# EAGLE design TempSensor (EAGLE 7.7.0)
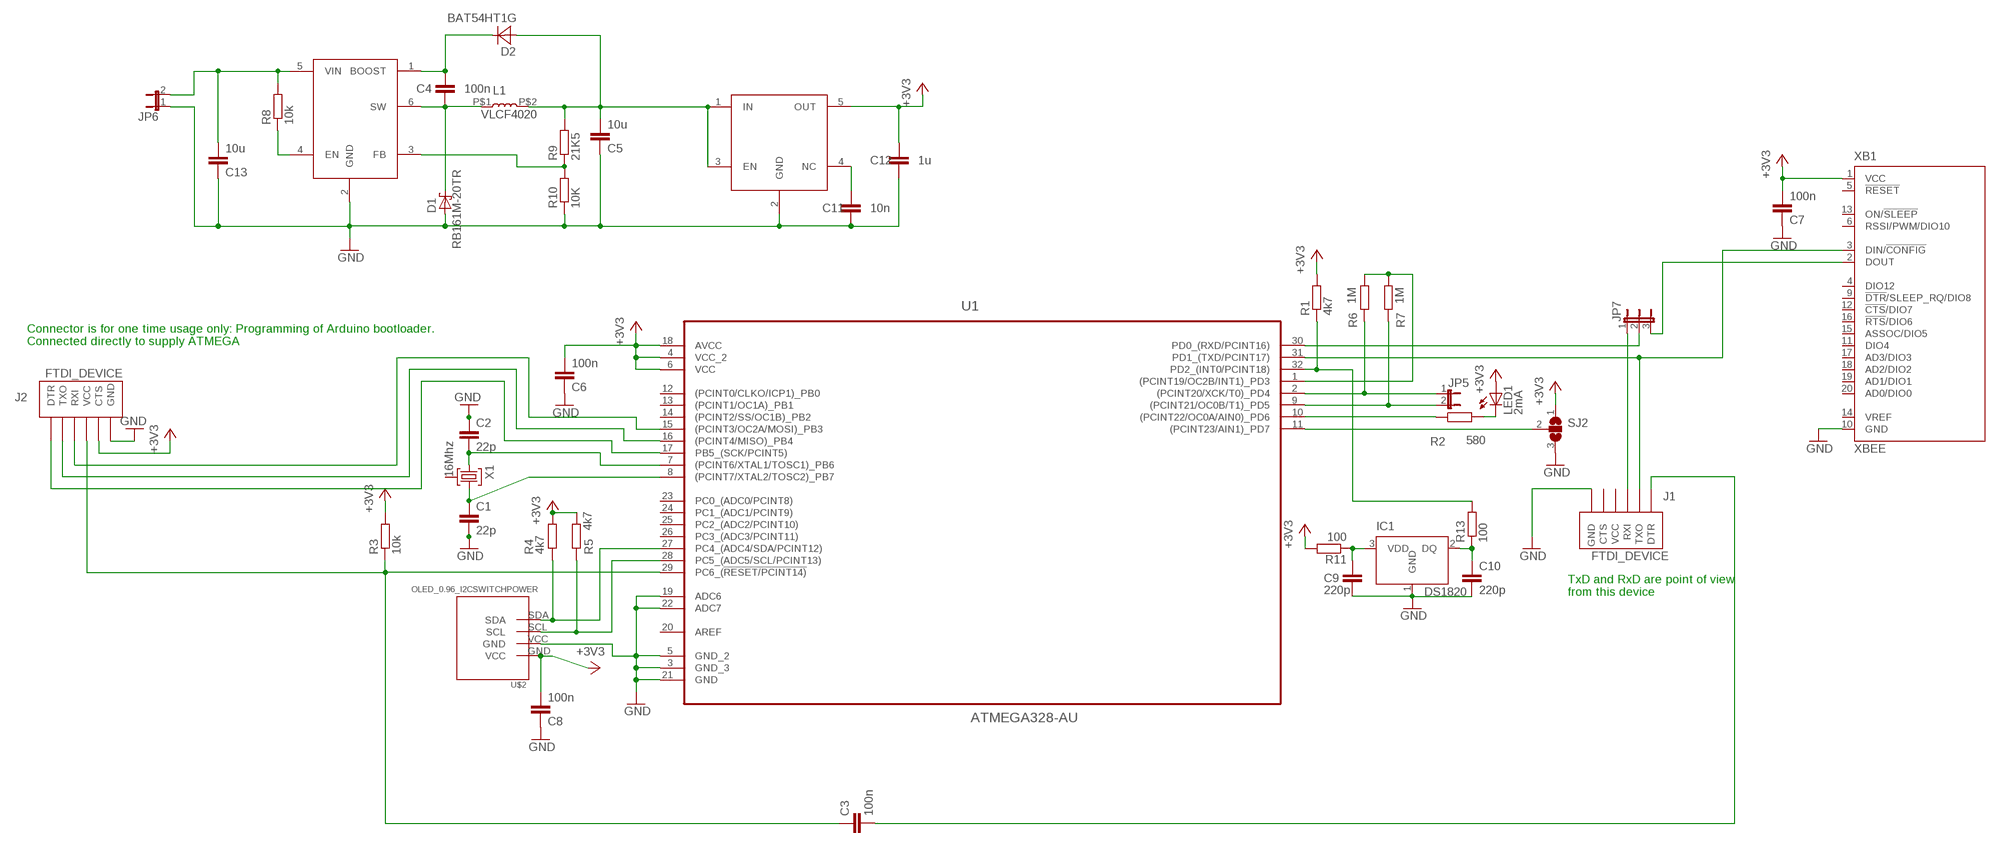
[diagram p0: schematic, sheet 1]

## Parts
C1  22p  C-EUC0805  [C0805]
C2  22p  C-EUC0805  [C0805]
C3  100n  C-EUC0805  [C0805]
C4  100n  C-EUC0805  [C0805]
C5  10u  C-EUC0805  [C0805]
C6  100n  C-EUC0805  [C0805]
C7  100n  C-EUC0805  [C0805]
C8  100n  C-EUC0805  [C0805]
C9  220p  C-EUC0805  [C0805]
C10  220p  C-EUC0805  [C0805]
C11  10n  C-EUC0805  [C0805]
C12  1u  C-EUC0805  [C0805]
C13  10u  C-EUC0805  [C0805]
D1  RB161M-20TR  [SOD123]
D2  BAT54HT1G  [SOD323_ST]
IC1  DS1820  [TO-92]
J1  FTDI_DEVICE  [FTDI_DEVICE_SIDE]
J2  FTDI_DEVICE  [FTDI_DEVICE_SIDE]
JP5  JP1E  [JP1]
JP6  JP1E  [JP1]
JP7  JP2E  [JP2]
L1  VLCF4020  [VLCF4020]
LED1  2mA  LED3MM  [LED3MM]
R1  4k7  R-EU_R0805  [R0805]
R2  580  R-EU_R0603  [R0603]
R3  10k  R-EU_R0805  [R0805]
R4  4k7  R-EU_R0805  [R0805]
R5  4k7  R-EU_R0805  [R0805]
R6  1M  R-EU_R0805  [R0805]
R7  1M  R-EU_R0805  [R0805]
R8  10k  R-EU_R0805  [R0805]
R9  21K5  R-EU_R0805  [R0805]
R10  10K  R-EU_R0805  [R0805]
R11  100  R-EU_R0805  [R0805]
R13  100  R-EU_R0805  [R0805]
SJ2  SJ2W  [SJ_2]
U1  ATMEGA328-AU  [QFP80P900X900X120-32N]
U2  LM2736X  [SOT23-6L]
U3  XC6210  [SOT23-5]
U$2  OLED_0.96_I2CSWITCHPOWER  [OLED_0.96_I2C]
X1  16Mhz  HC49-HC49-3L  [HC49-3L]
XB1  XBEE  [XBEE]

## Nets
+3V3 [Power]: C6.2 C7.2 C8.2 C12.2 J2.P$5(CTS) LED1.A R1.2 R3.2 R4.2 R5.2 R11.2 SJ2.1 U1.4(VCC_2) U1.6(VCC) U1.18(AVCC) U3.5(OUT) U$2.GND(VCC) XB1.1(VCC)
GND [Power]: C1.2 C2.1 C5.1 C6.1 C7.1 C8.1 C9.1 C10.1 C11.1 C12.1 C13.1 D1.A IC1.1(GND) J1.P$6(GND) J2.P$6(GND) JP6.1 R10.1 SJ2.3 U1.3(GND_3) U1.5(GND_2) U1.19(ADC6) U1.21(GND) U1.22(ADC7) U2.2(GND) U3.2(GND) U$2.VCC(GND) XB1.10(GND)
N$1: C2.2 U1.7((PCINT6/XTAL1/TOSC1)_PB6) X1.1
N$2: C1.1 U1.8((PCINT7/XTAL2/TOSC2)_PB7) X1.3
N$3: J1.P$3(RXI) JP7.1
N$4: JP7.2 U1.30(PD0_(RXD/PCINT16))
N$5: J1.P$2(TXO) U1.31(PD1_(TXD/PCINT17)) XB1.3(DIN/!CONFIG)
N$6: R1.1 R13.2 U1.32(PD2_(INT0/PCINT18))
N$10: R6.2 R7.2 U1.1((PCINT19/OC2B/INT1)_PD3)
N$11 [Power]: C4.1 D1.C L1.P$1 U2.6(SW)
N$12: JP5.1 R6.1 U1.2((PCINT20/XCK/T0)_PD4)
N$13: JP5.2 R7.1 U1.9((PCINT21/OC0B/T1)_PD5)
N$14: R9.1 R10.2 U2.3(FB)
N$15: LED1.K(C) R2.2
N$16: R2.1 U1.10((PCINT22/OC0A/AIN0)_PD6)
N$17: SJ2.2 U1.11((PCINT23/AIN1)_PD7)
N$18: JP7.3 XB1.2(DOUT)
N$19 [Power]: C4.2 D2.C U2.1(BOOST)
N$20: C3.1 J2.P$4(VCC) R3.1 U1.29(PC6_(!RESET/PCINT14))
N$21: C3.2 J1.P$1(DTR)
N$22: J2.P$3(RXI) U1.15((PCINT3/OC2A/MOSI)_PB3)
N$23: J2.P$1(DTR) U1.17(PB5_(SCK/PCINT5))
N$24: J2.P$2(TXO) U1.16((PCINT4/MISO)_PB4)
N$25: R8.1 U2.4(EN)
N$26: C9.2 IC1.3(VDD) R11.1
N$27: C10.2 IC1.2(DQ) R13.1
N$29: C11.2 U3.4(NC)
SCL: R5.1 U1.28(PC5_(ADC5/SCL/PCINT13)) U$2.SCL
SDA: R4.1 U1.27(PC4_(ADC4/SDA/PCINT12)) U$2.SDA
VIN [Power]: C13.2 JP6.2 R8.2 U2.5(VIN)
VO [Power]: C5.2 D2.A L1.P$2 R9.2 U3.1(IN) U3.3(EN)
Unconnected: J1.P$4(VCC) J1.P$5(CTS) U1.12((PCINT0/CLKO/ICP1)_PB0) U1.13((PCINT1/OC1A)_PB1) U1.14((PCINT2/SS/OC1B)_PB2) U1.20(AREF) U1.23(PC0_(ADC0/PCINT8)) U1.24(PC1_(ADC1/PCINT9)) U1.25(PC2_(ADC2/PCINT10)) U1.26(PC3_(ADC3/PCINT11)) X1.2 XB1.4(DIO12) XB1.5(!RESET) XB1.6(RSSI/PWM/DIO10) XB1.9(!DTR!/SLEEP_RQ/DIO8) XB1.11(DIO4) XB1.12(!CTS!/DIO7) XB1.13(ON/!SLEEP) XB1.14(VREF) XB1.15(ASSOC/DIO5) XB1.16(!RTS!/DIO6) XB1.17(AD3/DIO3) XB1.18(AD2/DIO2) XB1.19(AD1/DIO1) XB1.20(AD0/DIO0)

## Notes on the sheet
- Connector is for one time usage only: Programming of Arduino bootloader.
  Connected directly to supply ATMEGA
- TxD and RxD are point of view
  from this device

## Library data of the parts
C1-C13 = rcl:C-EU: CAPACITOR, European symbol
D1 = Components:RB161M-20TR
D2 = Components:BAT54HT1G
IC1 = DS1820:DS1820: DS1820 - 1-Wire Digital Thermometer
J1 J2 = SparkFun-Connectors:FTDI_DEVICE: Connector which mates to FTDI basic or FTDI cable.
JP5 JP6 = jumper:JP1E: JUMPER
JP7 = jumper:JP2E: JUMPER
L1 = Components:VLCF4020
LED1 = led:LED: LED OSRAM: - CHIPLED LG R971, LG N971, LY N971, LG Q971, LY Q971, LO R971, LY R971 LH N974, LH R974 LS Q976, LO Q976, LY Q976 LO Q996 - Hyper CHIPLED LW Q18S LB Q993, LB Q99A, LB R99A - SideLED LS A670, LO A670, LY A670, LG A670, LP A670 LB A673, LV A673, LT A673, LW A673 LH A674 LY A675 LS A676, LA A676, LO A676, LY A676, LW A676 LS A679, LY A679, LG A679 - Hyper Micro SIDELED® LS Y876, LA Y876, LO Y876, LY Y876 LT Y87S - SmartLED LW L88C, LW L88S LB L89C, LB L89S, LG L890 LS L89K, LO L89K, LY L89K LS L896, LA L896, LO L896, LY L896 - TOPLED LS T670, LO T670, LY T670, LG T670, LP T670 LSG T670, LSP T670, LSY T670, LOP T670, LYG T670 LG T671, LOG T671, LSG T671 LB T673, LV T673, LT T673, LW T673 LH T674 LS T676, LA T676, LO T676, LY T676, LB T676, LH T676, LSB T676, LW T676 LB T67C, LV T67C, LT T67C, LS T67K, LO T67K, LY T67K, LW E67C LS E67B, LA E67B, LO E67B, LY E67B, LB E67C, LV E67C, LT E67C LW T67C LS T679, LY T679, LG T679 LS T770, LO T770, LY T770, LG T770, LP T770 LB T773, LV T773, LT T773, LW T773 LH T774 LS E675, LA E675, LY E675, LS T675 LS T776, LA T776, LO T776, LY T776, LB T776 LHGB T686 LT T68C, LB T68C - Hyper Mini TOPLED® LB M676 - Mini TOPLED Santana® LG M470 LS M47K, LO M47K, LY M47K Source: http://www.osram.convergy.de LUXEON: - LUMILED® LXK2-PW12-R00, LXK2-PW12-S00, LXK2-PW14-U00, LXK2-PW14-V00 LXK2-PM12-R00, LXK2-PM12-S00, LXK2-PM14-U00 LXK2-PE12-Q00, LXK2-PE12-R00, LXK2-PE12-S00, LXK2-PE14-T00, LXK2-PE14-U00 LXK2-PB12-K00, LXK2-PB12-L00, LXK2-PB12-M00, LXK2-PB14-N00, LXK2-PB14-P00, LXK2-PB14-Q00 LXK2-PR12-L00, LXK2-PR12-M00, LXK2-PR14-Q00, LXK2-PR14-R00 LXK2-PD12-Q00, LXK2-PD12-R00, LXK2-PD12-S00 LXK2-PH12-R00, LXK2-PH12-S00 LXK2-PL12-P00, LXK2-PL12-Q00, LXK2-PL12-R00 Source: www.luxeon.com KINGBRIGHT: KA-3528ASYC Source: www.kingbright.com
R1-R11 R13 = rcl:R-EU_: RESISTOR, European symbol
SJ2 = jumper:SJ2W: SMD solder JUMPER
U1 = Components:ATMEGA328-AU: MCU, 8BIT, AVR, 32K FLASH, TQFP-32; MF: ATMEL; MPN: ATMEGA328-AU; OC_FARNELL: 1972086; OC_NEWARK: 68T2926; PACKAGE: TQFP-32; SUPPLIER: ATMEL
U2 = Components:LM2736X
U3 = Components:XC6210
U$2 = tft_1.8_1.44_oled_0.96:OLED_0.96_I2C
X1 = IQD-Frequency-Products:HC49: Crystals; MF: IQD FREQUENCY PRODUCTS; MFD: IQD Frequency Products; MPN: LFXTAL003240; OC_FARNELL: 9713700
XB1 = xbee:XBEE: XBee (TM) /XBee-PRO(TM) OEM RF Modules Source: MaxStream, Inc. xbee_productmanual.pdf; MPN: XBP24-Z7UIT-004; OC_FARNELL: 1751799; OC_NEWARK: 34R5507

## Net classes
1 Power: width 0.508 mm

## Board
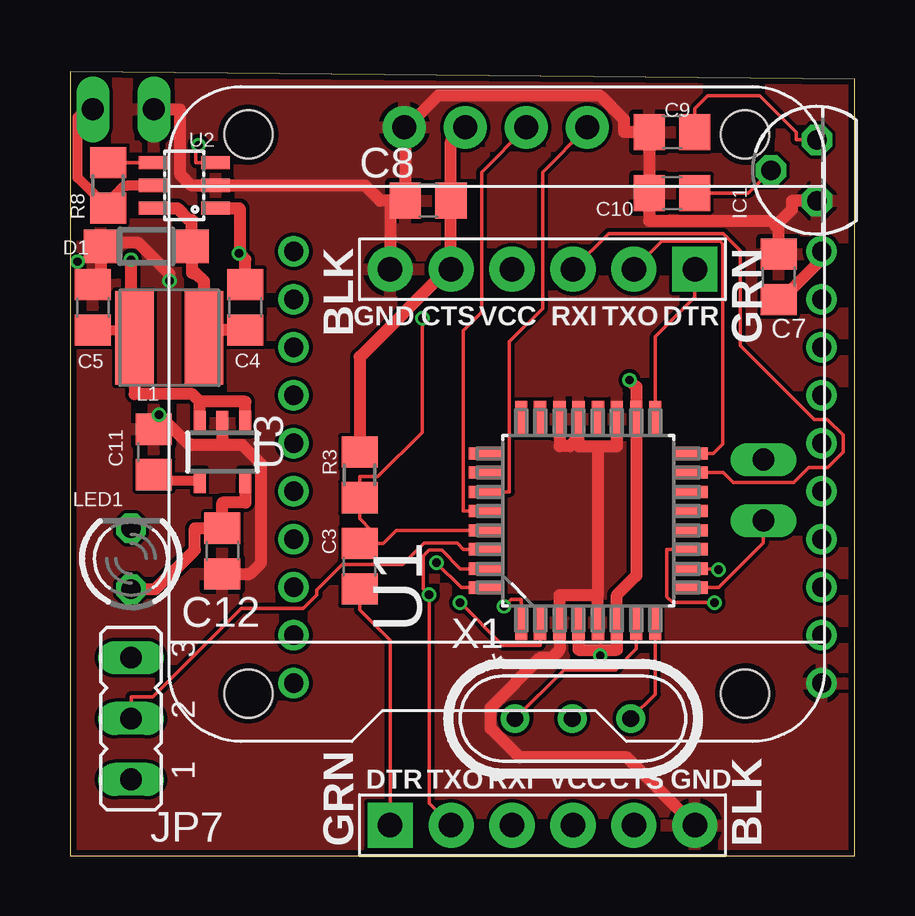
[diagram p1: board, top side]
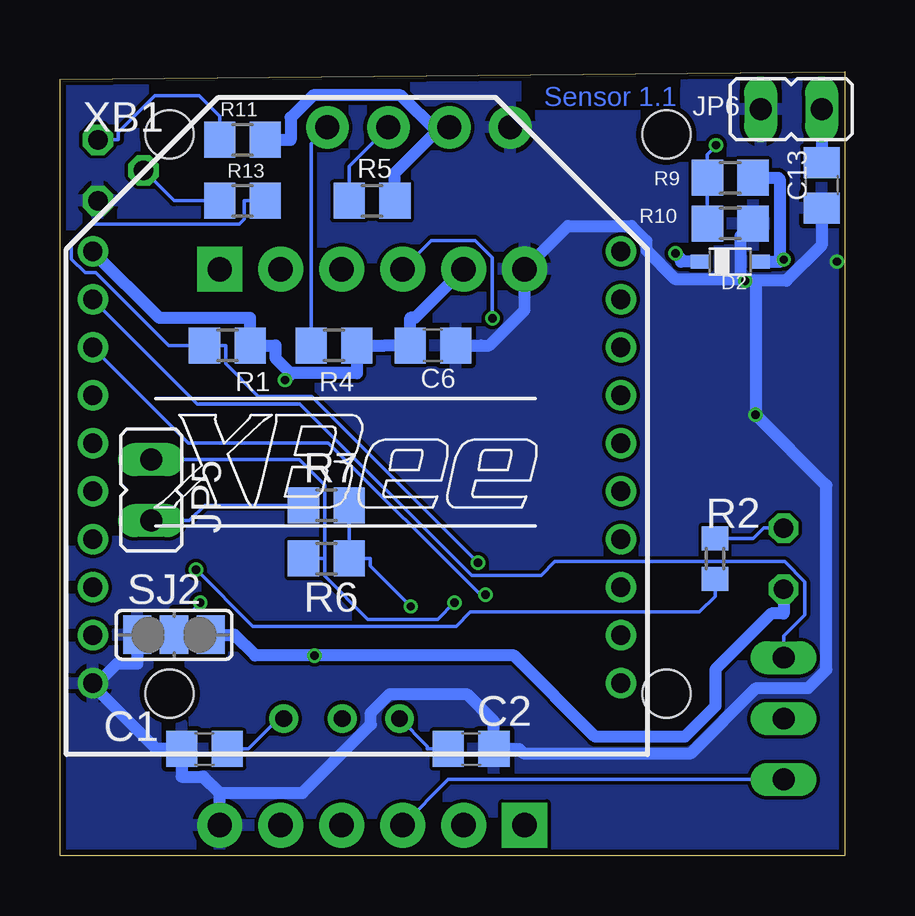
[diagram p2: board, bottom side, seen from below]

Size 32.69 x 32.69 mm. Coordinates in mm from the lower left corner, seen from the top.
Outline: 0,0 32.69,0 32.69,32.38 0,32.69 0,0
Copper layers (1*16): Top 0.018mm / dielectric 1.55mm / Bottom 0.018mm
Design rules "eC_2Layer_PClass6_BaseCopperO18_eCDefault": minimum track width 0.15mm, minimum drill 0.35mm, track to track 0.15mm, track to pad 0.15mm, pad to pad 0.15mm, via to via 0.15mm, smd to smd 0mil, copper to edge 0.25mm, drill to drill 0.35mm, minimum pad ring 0.175mm, minimum via ring 0.125mm, stop-mask expansion 0mil, vias tented up to drill 0.45mm, thermal gap 0.2mm

### Footprints (pad centres in the part's own frame; a part is rotated, then mirrored left to right if it is on the bottom)
C0805 = smd 1.3 x 1.5: 1 -0.95,0; 2 0.95,0
SOD123 = smd 1.4 x 1.4: A 1.9,0; C -1.9,0
SOD323_ST = smd 0.8 x 0.6: A 1.25,0; C -1.25,0
TO-92 = drill 0.813 pad 1.27 octagon: 1 -1.27,0; 2 0,1.905; 3 1.27,0
FTDI_DEVICE_SIDE = drill 1.016 pad 1.88 square: P$1 -6.35,0 | drill 1.016 pad 1.88: P$2 -3.81,0; P$3 -1.27,0; P$4 1.27,0; P$5 3.81,0; P$6 6.35,0
JP1 = drill 0.914 long: 1 0,-1.27; 2 0,1.27
JP2 = drill 0.914 long: 1 -2.54,0; 2 0,0; 3 2.54,0
VLCF4020 = smd 3.9 x 1.6: P$1 0,-1.46; P$2 0,1.44
LED3MM = drill 0.813 octagon: A -1.27,0; K 1.27,0
R0805 = smd 1.3 x 1.5: 1 -0.95,0; 2 0.95,0
R0603 = smd 1 x 1.1: 1 -0.85,0; 2 0.85,0
SJ_2 = smd 1.168 x 1.6: 1 -1.524,0; 2 0,0; 3 1.524,0
QFP80P900X900X120-32N = smd 1.473 x 0.508: 1 -4.242,2.794; 2 -4.242,2.007; 3 -4.242,1.194; 4 -4.242,0.406; 5 -4.242,-0.406; 6 -4.242,-1.194; 7 -4.242,-2.007; 8 -4.242,-2.794; 17 4.242,-2.794; 18 4.242,-2.007; 19 4.242,-1.194; 20 4.242,-0.406; 21 4.242,0.406; 22 4.242,1.194; 23 4.242,2.007; 24 4.242,2.794 | smd 0.508 x 1.473: 9 -2.794,-4.242; 10 -2.007,-4.242; 11 -1.194,-4.242; 12 -0.406,-4.242; 13 0.406,-4.242; 14 1.194,-4.242; 15 2.007,-4.242; 16 2.794,-4.242; 25 2.794,4.242; 26 2.007,4.242; 27 1.194,4.242; 28 0.406,4.242; 29 -0.406,4.242; 30 -1.194,4.242; 31 -2.007,4.242; 32 -2.794,4.242
SOT23-6L = smd 0.55 x 1.2: 1 -0.95,-1.3; 2 0,-1.3; 3 0.95,-1.3; 4 0.95,1.3; 5 0,1.3; 6 -0.95,1.3
SOT23-5 = smd 0.5 x 1: 1 -0.95,-1.2; 2 0,-1.2; 3 0.95,-1.2; 4 0.95,1.2; 5 -0.95,1.2
OLED_0.96_I2C = drill 1 pad 1.778: GND -1.63,11.63; SCL 0.91,11.63; SDA 3.45,11.63; VCC -4.17,11.63 | hole 2: -10.67,-11.97; 10.03,-11.97; 10.03,11.33; -10.67,11.33
HC49-3L = drill 0.7 pad 1.2: 1 -2.413,0; 2 -0.027,0; 3 2.413,0
XBEE = drill 0.8 pad 1.27: 1 -11,9; 2 -11,7; 3 -11,5; 4 -11,3; 5 -11,1; 6 -11,-1; 7 -11,-3; 8 -11,-5; 9 -11,-7; 10 -11,-9; 11 11,-9; 12 11,-7; 13 11,-5; 14 11,-3; 15 11,-1; 16 11,1; 17 11,3; 18 11,5; 19 11,7; 20 11,9

### Placement (x,y rotation side)
C1  26.67,4.45 180 bottom
C2  15.56,4.45 180 bottom
C3  12.07,12.06 270 top
C4  7.3,22.86 90 top
C5  0.95,22.86 270 top
C6  17.15,21.27 180 bottom
C7  29.53,24.13 270 top
C8  14.92,27.3 0 top
C9  25.08,30.16 0 top
C10  25.08,27.62 0 top
C11  3.49,16.83 270 top
C12  6.35,12.7 90 top
C13  0.95,27.94 90 bottom
D1  3.18,25.4 180 top
D2  4.76,24.77 0 bottom
IC1  31.11,28.58 90 top
J1  19.69,1.27 0 top
J2  19.69,24.45 180 top
JP5  28.89,15.24 180 bottom
JP6  2.22,31.12 270 bottom
JP7  2.54,5.71 90 top
L1  4.13,21.59 90 top
LED1  2.54,12.38 90 top
R1  25.72,21.27 0 bottom
R2  5.4,12.38 90 bottom
R3  12.07,15.88 90 top
R4  21.27,21.27 0 bottom
R5  19.69,27.3 0 bottom
R6  21.59,12.38 0 bottom
R7  21.59,14.6 0 bottom
R8  1.59,27.94 270 top
R9  4.76,28.26 0 bottom
R10  4.76,26.35 180 bottom
R11  25.08,29.84 0 bottom
R13  25.08,27.3 0 bottom
SJ2  27.94,9.21 180 bottom
U1  21.59,13.97 90 top
U2  4.76,27.94 90 top
U3  6.35,16.83 180 top
U$2  18.1,18.73 0 top
X1  20.95,5.71 0 top
XB1  20.32,16.19 0 bottom

### Tracks (layer width: path | path; a pad name or v marks a point on that pad's centre or on a via)
+3V3  (via drill 0.35 pad 0.6)
  Top 0.508: U$2.GND 15.87,29.77 C8.2 J2.P$5 | 22.09,8.59 22.78,8.59 U1.6 22.78,10.87 23.6,11.68 U1.18 23.6,19.54 v23.31,19.83 | 22.09,8.59 21.18,8.59 U1.4 | 22.09,8.59 v22.09,8.34 | U3.5 7.3,14.72 6.37,14.72 6.35,14.7 C12.2 5.2,13.65 5.2,12.76 3.55,11.11 LED1.A | J2.P$5 15.73,24.45 12.07,20.79 R3.2 | XB1.1 31.32,24.88 29.62,23.18 C7.2 | J2.P$5
  Bottom 0.508: XB1.1 28.55,22.43 24.77,22.43 R1.2 23.71,21.27 23.71,20.75 23.09,20.12 | 23.09,20.12 20.32,20.12 R4.2 19.15,21.27 C6.2 18.09,22.43 17.9,22.43 J2.P$5 | LED1.A 2.54,10.1 3.05,10.1 5.38,7.77 5.38,6.23 6.66,4.96 10.38,4.96 13.76,8.34 v22.09,8.34 24.56,8.34 25.43,9.21 SJ2.1 | 23.09,20.12 23.09,20.05 v23.31,19.83 | 17,30.19 18.73,28.46 R5.2 | U$2.GND 16.58,30.25 16.94,30.25 17,30.19 | 17,30.19 18.51,31.7 22.15,31.7 23.08,30.77 23.08,29.84 R11.2
GND  (via drill 0.35 pad 0.6)
  Top 0.508: v4.14,23.97 4.14,24.26 2.84,25.55 1.43,25.55 D1.A 1.27,24.3 0.95,23.97 C5.1 | IC1.1 30.08,27.3 30.08,26.94 29.4,26.26 | 29.4,26.26 29.53,26.13 C7.1 | 29.4,26.26 29.19,26.47 24.13,26.47 C10.1 C9.1 23.08,30.16 23.08,30.69 22.07,31.7 15.35,31.7 13.97,30.32 | 21.18,17.43 20.83,17.07 20.4,17.07 U1.22 | 21.18,17.43 21.18,17.64 U1.21 | 21.18,17.43 21.18,17.07 21.98,17.07 | C12.1 7.5,11.75 7.96,12.2 7.96,16.33 7.17,17.12 6.35,17.12 | U3.2 6.35,17.12 | 6.35,17.12 4.96,17.12 v3.7,18.38 3.66,18.38 3.06,17.78 C11.1 | J1.P$6 23.21,4.09 18.74,4.09 17.53,5.3 17.53,6.17 19.62,8.26 20.07,8.26 20.4,8.59 U1.3 20.4,10.87 21.98,10.87 | 21.98,10.87 22,10.87 U1.5 | 21.98,17.07 21.98,10.87 | 21.98,17.07 22.78,17.07 U1.19 | JP6.1 4.58,31.12 4.58,28.42 5.06,27.94 U2.2 12.28,27.94 12.92,27.3 13.45,27.3 | 13.45,27.3 13.34,27.19 J2.P$6 | 13.45,27.3 C8.1 13.97,30.32 | U$2.VCC 13.97,30.32
  Bottom 0.508: C13.1 0.95,25.44 2.42,23.97 3.7,23.97 | 3.7,23.97 v4.14,23.97 4.26,23.97 4.33,24.05 | 3.7,23.97 v3.7,18.38 0.75,15.43 0.75,7.75 1.52,6.98 3.68,6.98 6.39,4.27 13.38,4.27 13.55,4.45 C2.1 14.61,4.54 14.61,5.6 15.75,6.74 18.95,6.74 19.73,5.95 19.73,5.47 22.59,2.61 26.04,2.61 | 4.33,24.05 4.33,25.83 R10.1 | 4.33,24.05 7.07,24.05 8.26,25.23 8.26,25.63 8.88,26.25 11.53,26.25 J2.P$6 13.34,22.75 14.81,21.27 15.14,21.27 C6.1 | 26.04,2.61 26.71,3.29 27.62,3.29 C1.2 28.67,4.45 31.13,6.9 31.13,7.19 | J1.P$6 26.04,2.61 | 31.13,7.19 30.32,8 29.46,8 SJ2.3 | XB1.10 31.13,7.19
  other vias: 0.32,24.77
  pour Bottom: 0,32.38 32.39,32.38 32.39,0 0,0
  pour Top: 0,32.38 32.39,32.38 32.39,0 0,0
N$1
  Top 0.15: X1.1 20.58,7.75 22.73,7.75 23.6,8.62 U1.7
  Bottom 0.15: C2.2 17.38,4.45 17.38,4.56 X1.1
N$2
  Top 0.15: X1.3 24.38,6.73 U1.8
  Bottom 0.15: C1.1 24.84,4.45 23.58,5.71 X1.3
N$3
  Bottom 0.15: JP7.1 16.51,3.18 J1.P$3
N$4
  Top 0.15: U1.30 16.39,12.78 16.13,13.04 14.75,13.04 13.86,12.14 11.34,12.14 10.29,11.09 10.29,10.86 9.72,10.3 7.12,10.3 3.45,6.63 2.54,6.63 JP7.2
N$5  (via drill 0.35 pad 0.6)
  Top 0.15: U1.31 16.26,11.96 15.49,12.74 14.97,12.74 14.72,12.49 14.72,11.12 v14.96,10.89 14.96,2.19 J1.P$2
  Bottom 0.15: v14.96,10.89 15.18,10.89 21.51,17.21 27.34,17.21 XB1.3
N$6  (via drill 0.35 pad 0.6)
  Top 0.15: U1.32 16.3,11.18 v15.27,12.21
  Bottom 0.15: v15.27,12.21 22.2,19.14 24.43,19.14 25.79,20.51 25.79,21.27 R1.1 28.17,21.27 31.19,24.3 31.65,24.3 32.22,24.87 32.22,25.58 31.47,26.32 25.23,26.32 25.01,26.54 25.01,27.3 R13.2
N$10  (via drill 0.35 pad 0.6)
  Top 0.15: v18.08,10.39 18.38,10.69 18.8,10.69 U1.1
  Bottom 0.15: v18.08,10.39 19.77,12.08 19.77,12.38 R6.2 R7.2
N$11
  Top 0.508: U2.6 4.47,26.99 4.95,26.5 5.08,26.5 D1.C 5.08,24.3 5.24,24.3 5.59,23.94 5.59,22.34 | C4.1 6.15,21.91 5.72,22.34 5.59,22.34 | L1.P$1 5.59,22.34
N$12  (via drill 0.35 pad 0.6)
  Top 0.15: U1.2 19.58,8.77 18.04,8.77 v16.26,10.55
  Bottom 0.15: v16.26,10.55 16.95,9.86 19.87,9.86 21.66,11.66 21.66,12.38 | 21.66,12.38 21.66,15.45 22.72,16.51 JP5.1 | R6.1 21.66,12.38
N$13
  Top 0.15: U1.9 26.79,11.18 27.02,11.18 28.89,13.05 28.89,13.06 JP5.2
  Bottom 0.15: JP5.2 27.3,13.97 26.66,14.6 R7.1
N$14  (via drill 0.35 pad 0.6)
  Top 0.15: U2.3 5.24,28.89 5.24,29.5 v5.36,29.62
  Bottom 0.15: v5.36,29.62 5.36,29.59 5.71,29.23 R9.1 R10.2
N$15
  Bottom 0.15: LED1.K 3.38,13.65 3.8,13.23 R2.2
N$16  (via drill 0.35 pad 0.6)
  Top 0.15: U1.10 26.98,11.96 v27.02,11.93
  Bottom 0.15: v27.02,11.93 24.65,9.56 16.18,9.56 15.59,10.15 6.05,10.15 5.4,10.81 R2.1
N$17  (via drill 0.35 pad 0.6)
  Top 0.15: U1.11 24.87,12.78 24.87,10.79 25.11,10.55 v26.84,10.55
  Bottom 0.15: SJ2.2 27.94,10.23 27.17,10.23 v26.84,10.55
N$18
  Bottom 0.15: JP7.3 2.54,9.17 1.66,10.05 1.66,11.42 2.5,12.26 12.07,12.26 12.65,11.68 15.54,11.68 22.69,18.84 26.97,18.84 XB1.2
N$19  (via drill 0.35 pad 0.6)
  Top 0.508: 7.07,25.11 7.07,25.1 7.3,24.86 C4.2 | 7.07,25.11 7.07,26.99 U2.1 | v7.04,25.11 7.07,25.11
  Bottom 0.508: D2.C 6.82,24.77 6.82,24.88 v7.04,25.11
N$20  (via drill 0.35 pad 0.6)
  Top 0.15: 12.55,13.02 12.55,13.56 12.07,14.05 R3.1 12.07,15.8 12.83,15.8 14.68,17.65 v14.68,22.4 | 12.55,13.02 13.04,13.02 13.59,13.56 16.39,13.56 U1.29 | C3.1 12.55,13.02
  Bottom 0.15: v14.68,22.4 14.68,24.93 15.39,25.64 17.22,25.64 J2.P$4
N$21
  Top 0.15: J1.P$1 13.34,2.43 13.34,8.97 12.07,10.24 C3.2
N$22
  Top 0.15: U1.15 27.22,15.98 27.64,15.55 30.15,15.55 30.79,16.19 31.57,16.19 32.22,16.83 32.22,17.53 31.56,18.19 31.01,18.19 27.92,21.28 27.92,25.23 27.22,25.94 22.45,25.94 J2.P$3
N$23
  Top 0.15: J2.P$1 26.04,23.28 24.38,21.63 U1.17
N$24
  Top 0.15: U1.16 26.79,16.76 27.2,17.17 27.2,25.5 27.09,25.61 24.66,25.61 J2.P$2
N$25
  Top 0.15: U2.4 R8.1
N$26
  Top 0.15: C9.2 26.03,31.14 26.58,31.68 28.74,31.68 30.25,30.17 30.25,29.84 IC1.3
  Bottom 0.15: IC1.3 30.25,29.84 30.25,30.17 28.74,31.68 26.9,31.68 26.03,30.82 R11.1
N$27
  Top 0.15: IC1.2 28.26,27.62 C10.2
  Bottom 0.15: R13.1 27.94,27.3 IC1.2
N$29
  Top 0.406: U3.4 3.49,15.63 C11.2
SCL
  Top 0.15: U1.28 16.39,14.38 16.39,21.9 17.15,22.66 17.15,28.5 U$2.SCL
  Bottom 0.15: U$2.SCL 20.64,28.73 R5.1
SDA
  Top 0.15: U1.27 18.31,15.16 18.31,21.43 19.69,22.81 19.69,28.5 U$2.SDA
  Bottom 0.15: U$2.SDA 22.22,29.69 R4.1
VIN
  Top 0.406: U2.5 2.54,27.94 2.37,27.92 2.2,27.88 1.65,27.29 R8.2 0.32,28.26 | 0.32,28.26 | 0.32,28.26 0.32,30.8 0.64,31.12 JP6.2
  Bottom 0.508: JP6.2 C13.2
VO  (via drill 0.35 pad 0.6)
  Top 0.406: 2.54,21.91 2.53,21.91 2.06,21.91 C5.2
  Top 0.508: v2.53,24.85 2.53,21.91 | 2.54,21.91 2.69,21.76 L1.P$2 2.69,19.24 5.1,19.24 5.4,18.93 | 5.4,18.93 7.3,18.93 U3.1 | U3.3 5.4,18.93
  Bottom 0.508: 2.71,24.85 2.71,24.77 D2.A | 2.71,24.85 2.71,28.21 2.76,28.26 R9.2 | v2.53,24.85 2.71,24.85

### Text on the board
Bottom: Sensor 1.1
_tNames: JP1 | U1 | X1 | IC1 | C2 | JP2 | C1 | JP3 | R1 | JP4 | JP5
_bNames: XB1